# EAGLE design MicrofluidicsController (EAGLE 7.2.0)
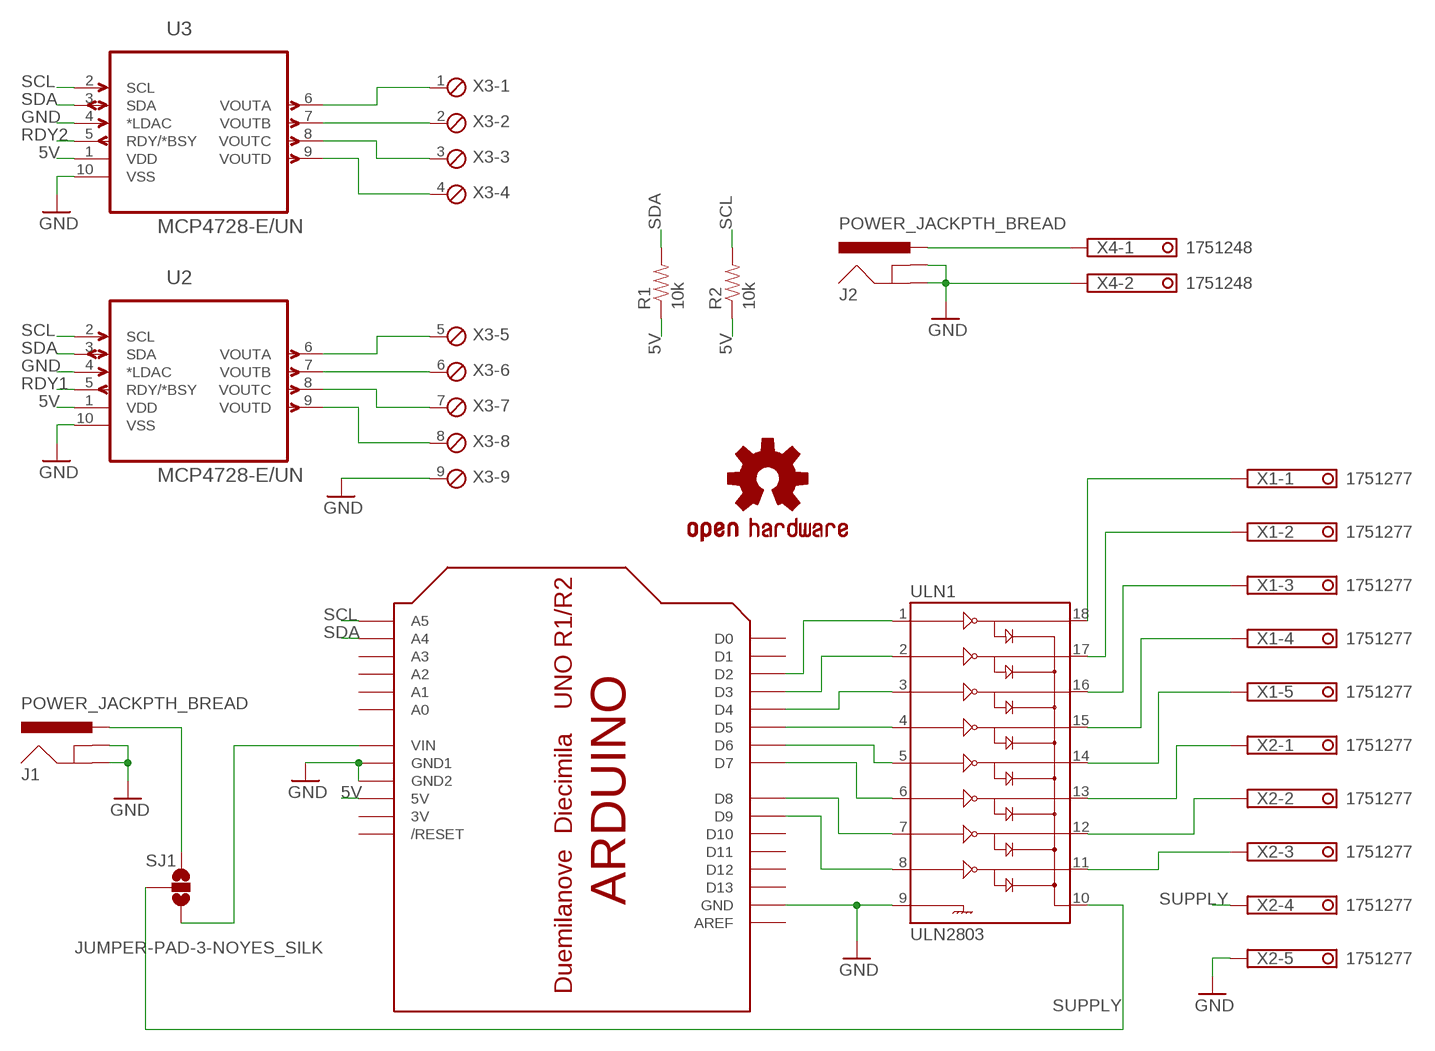
[diagram p0: schematic, sheet 1]

## Parts
J1  POWER_JACKPTH_BREAD  [POWER_JACK_PTH_BREAD]
J2  POWER_JACKPTH_BREAD  [POWER_JACK_PTH_BREAD]
LOGO1  OSHW-LOGOL  [OSHW-LOGO-L]
R1  10k  RESISTOR0603-RES  [0603-RES]
R2  10k  RESISTOR0603-RES  [0603-RES]
SJ1  JUMPER-PAD-3-NOYES_SILK  [PAD-JUMPER-3-NO_YES_SILK]
U2  MCP4728-E/UN  [SOP50P490X110-10N]
U3  MCP4728-E/UN  [SOP50P490X110-10N]
U$1  ARDUINOUNO  [ARDUINO]
ULN1  ULN2803  ULN2803DIP  [DIL18]
X1  1751277  [1751277]
X2  1751277  [1751277]
X3  MPT9  [9POL254]
X4  1751248  [1751248]

## Nets
5V: R1.1 R2.1 U2.1(VDD) U3.1(VDD) U$1.5V
GND: J1.GND J1.GNDBREAK J2.GND J2.GNDBREAK U2.4(*LDAC) U2.10(VSS) U3.4(*LDAC) U3.10(VSS) U$1.GND U$1.GND1 U$1.GND2 ULN1.9 X2.5 X3.9 X4.2
N$1: SJ1.3 U$1.VIN
N$2: U$1.D2 ULN1.1
N$3: U$1.D3 ULN1.2
N$4: U$1.D4 ULN1.3
N$5: U$1.D5 ULN1.4
N$6: U$1.D6 ULN1.5
N$7: U$1.D7 ULN1.6
N$8: U$1.D8 ULN1.7
N$9: U$1.D9 ULN1.8
N$11: J1.PWR SJ1.1
N$12: ULN1.18 X1.1
N$13: ULN1.17 X1.2
N$14: ULN1.16 X1.3
N$15: ULN1.15 X1.4
N$16: ULN1.14 X1.5
N$17: ULN1.13 X2.1
N$18: ULN1.12 X2.2
N$19: ULN1.11 X2.3
N$20: U2.6(VOUTA) X3.5
N$21: U2.7(VOUTB) X3.6
N$22: U2.8(VOUTC) X3.7
N$23: U2.9(VOUTD) X3.8
N$24: U3.6(VOUTA) X3.1
N$25: U3.7(VOUTB) X3.2
N$26: U3.8(VOUTC) X3.3
N$27: U3.9(VOUTD) X3.4
N$33: J2.PWR X4.1
RDY1: U2.5(RDY/*BSY)
RDY2: U3.5(RDY/*BSY)
SCL: R2.2 U2.2(SCL) U3.2(SCL) U$1.A5
SDA: R1.2 U2.3(SDA) U3.3(SDA) U$1.A4
SUPPLY: SJ1.2 ULN1.10 X2.4
Unconnected: U$1.A0 U$1.A1 U$1.A2 U$1.A3 U$1.AREF U$1.D0 U$1.D1 U$1.D10 U$1.D11 U$1.D12 U$1.D13 U$1.RESET(/RESET)

## Power pins joined to a net without a drawn wire
3V: U$1.3V

## Library data of the parts
J1 J2 = SparkFun-Connectors:POWER_JACK: Power Jack This is the standard 5.5mm barrel jack for power. The PTH is the most common, proven, reliable, footprint. The Slot footprint only works if the mill layer is transmitted to the PCB fab house so be warned. Mating wall wart : TOL-00298 (and others); PROD_ID: PRT-10811
LOGO1 = SparkFun-Aesthetics:OSHW-LOGO: Open Source Hardware Logo This logo indicates the piece of hardware it is found on incorporates a OSHW license and/or adheres to the definition of open source hardware found here: http://freedomdefined.org/OSHW
R1 R2 = SparkFun-Passives:RESISTOR: Resistor Basic schematic elements and footprints for 0603, 1206, and PTH resistors.
SJ1 = SparkFun-Passives:JUMPER-PAD-3-NO
U2 U3 = mylibrary:MCP4728-E/UN: IC, DAC, 12BIT, QUAD; MPN: MCP4728-E/UN; OC_FARNELL: 1800217; OC_NEWARK: 08R1808; PACKAGE: MSOP-10; SUPPLIER: MICROCHIP
U$1 = adafruit:ARDUINO: Arduino Diecimila/Duemilanove Make a shield with ease, this package has all the named pins as well as the two mounting drill holes and an outline of the USB and DC power connector. The outline is on the DIMENSION layer, so if your board house uses it they will cut the outline to match. http://www.ladyada.net/library/pcb/eaglelibrary.html
ULN1 = SparkFun-PowerIC:ULN2803: Darlington Driver ULN2803 Darlington array. 500mA max per channel, 8-channel package. Spark Fun Electronics SKU : COM-00312
X1 X2 = con-phoenix-350:1751277: MKDS 1/ 5-3,5 Printklemme Nennstrom: 10 A Bemessungsspannung: 160 V Raster: 3,5 mm Polzahl: 5 Montageart: Löten Anschlussart: Schraubanschluss Anschlussrichtung vom Leiter zur Platine: 0° Source: http://eshop.phoenixcontact.com .. 1751277.pdf; OC_FARNELL: unknown; OC_NEWARK: unknown
X3 = con-phoenix-254:MPT9: PHOENIX CONNECTOR; OC_FARNELL: unknown; OC_NEWARK: unknown
X4 = con-phoenix-350:1751248: MKDS 1/ 2-3,5 Printklemme Nennstrom: 10 A Bemessungsspannung: 160 V Raster: 3,5 mm Polzahl: 2 Montageart: Löten Anschlussart: Schraubanschluss Anschlussrichtung vom Leiter zur Platine: 0° Source: http://eshop.phoenixcontact.com .. 1751248.pdf; OC_FARNELL: unknown; OC_NEWARK: unknown

## Board
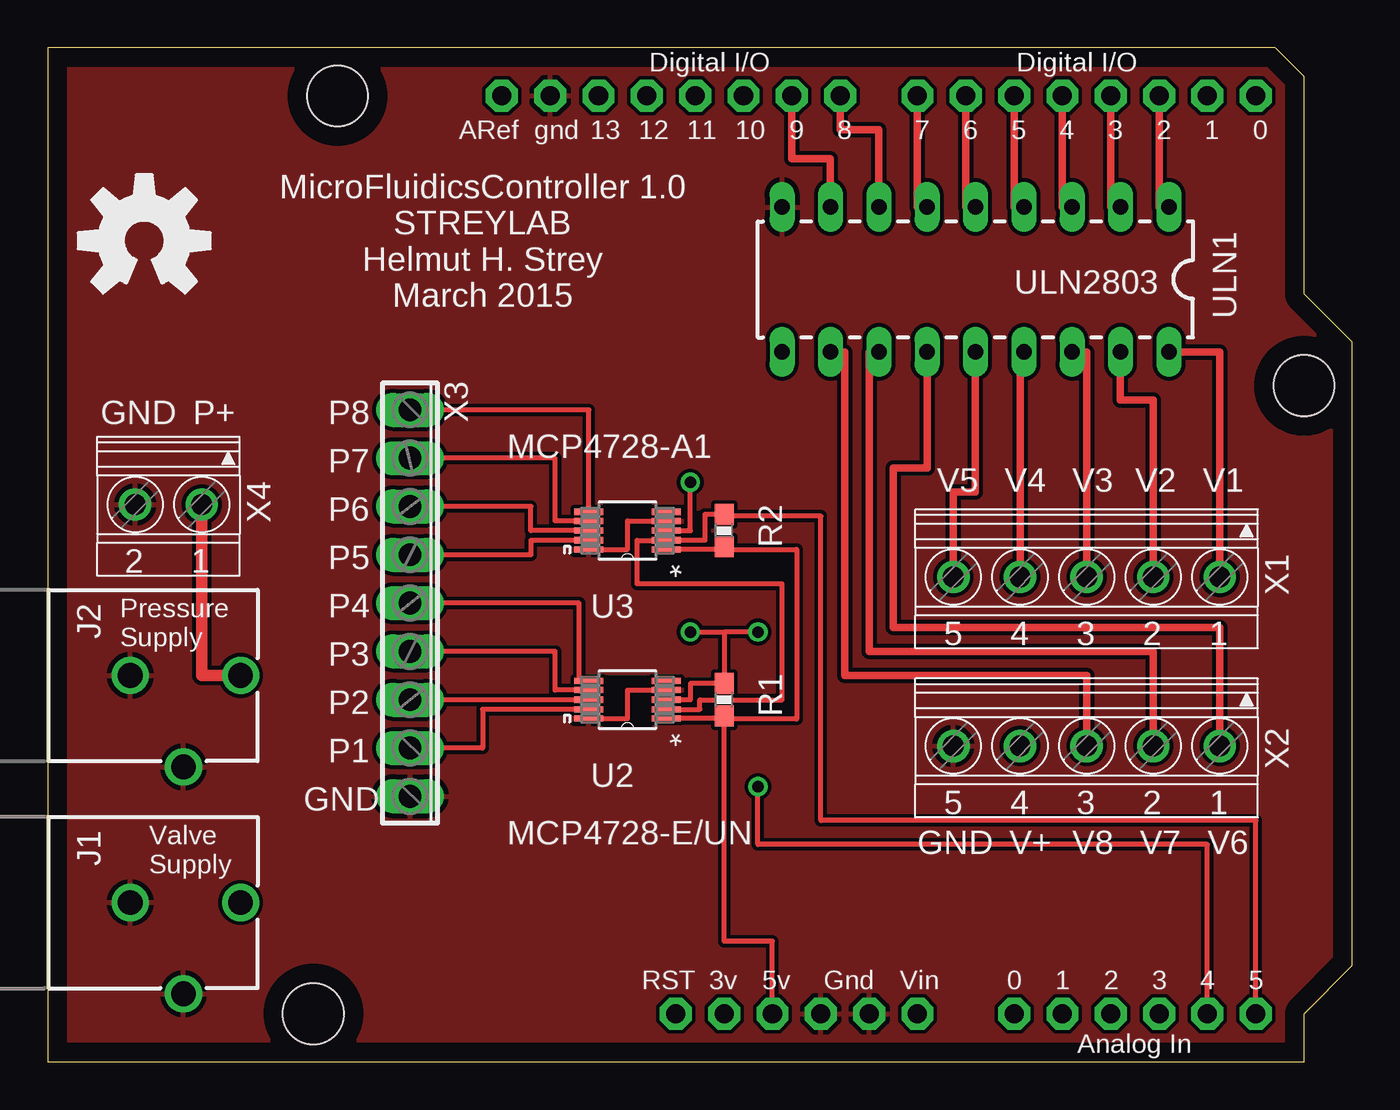
[diagram p1: board, top side]
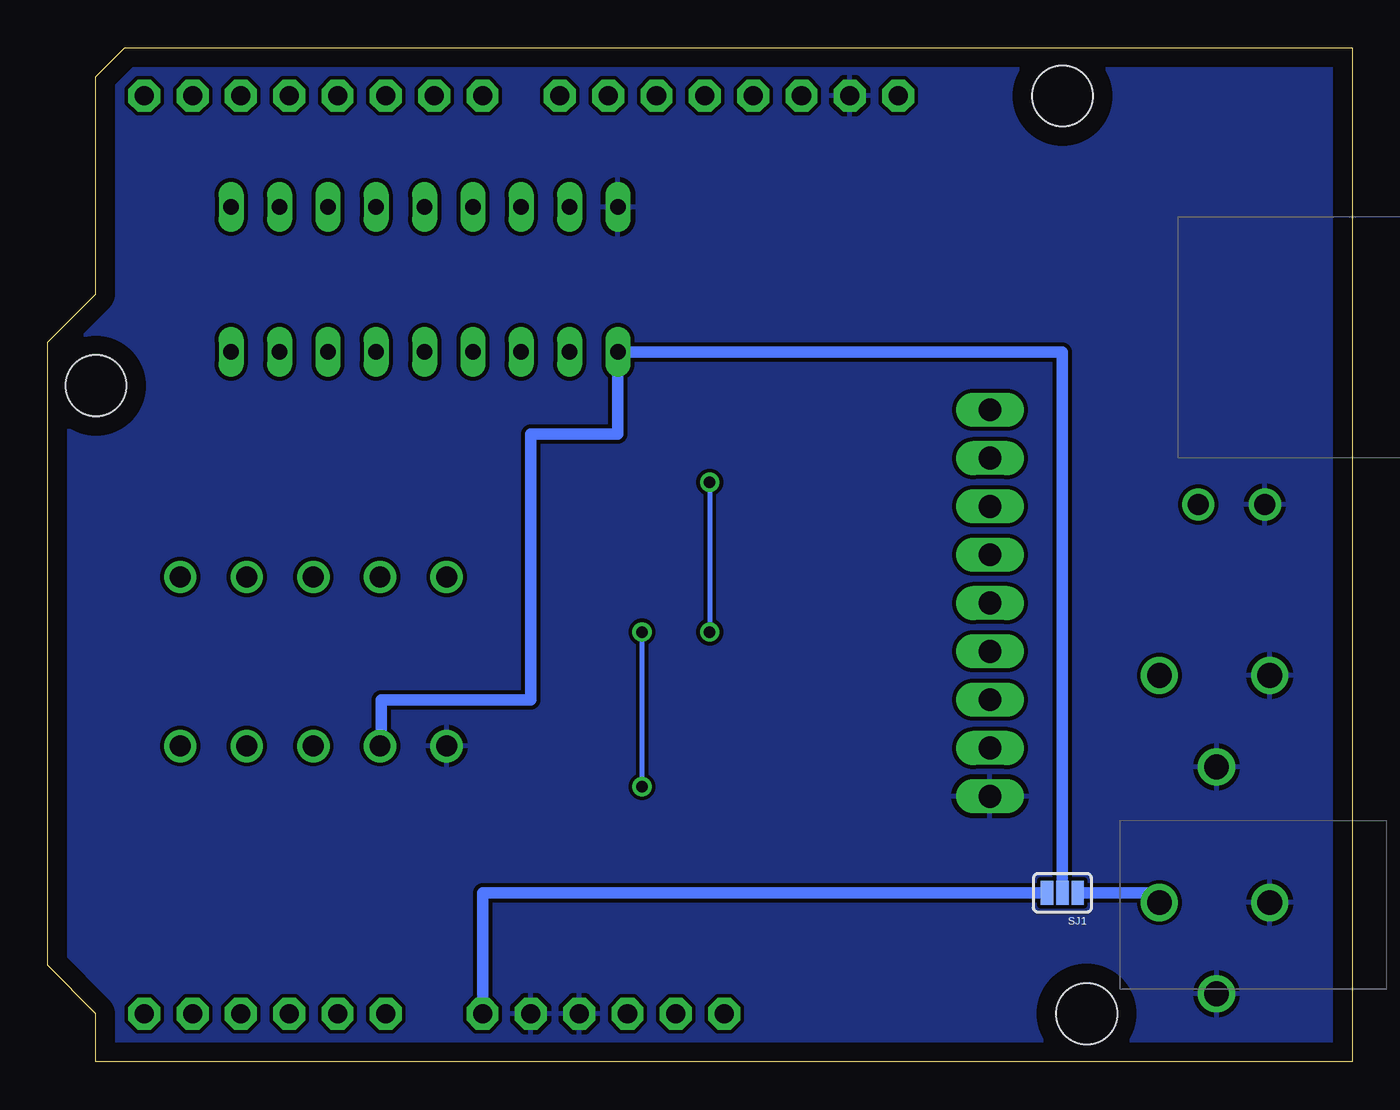
[diagram p2: board, bottom side, seen from below]

Size 68.58 x 53.34 mm. Coordinates in mm from the lower left corner, seen from the top.
Copper layers (1*16): Top 0.035mm / dielectric 1.5mm / Bottom 0.035mm
Design rules "default": minimum track width 10mil, minimum drill 24mil, track to track 8mil, track to pad 8mil, pad to pad 8mil, via to via 8mil, smd to smd 8mil, copper to edge 40mil, drill to drill 8mil, minimum pad ring 10mil, minimum via ring 8mil, stop-mask expansion 4mil, vias tented up to drill 0mil, thermal gap 10mil

### Footprints (pad centres in the part's own frame; a part is rotated, then mirrored left to right if it is on the bottom)
POWER_JACK_PTH_BREAD = drill 1.3: GND 0,7.9; GNDBREAK 4.8,10.7; PWR 0,13.7
0603-RES = smd 1.1 x 1: 1 -0.85,0; 2 0.85,0
PAD-JUMPER-3-NO_YES_SILK = smd 0.635 x 1.27: 1 -0.813,0; 2 0,0; 3 0.813,0
SOP50P490X110-10N = smd 1.524 x 0.33: 1 -2.032,0.991; 2 -2.032,0.508; 3 -2.032,0; 4 -2.032,-0.508; 5 -2.032,-0.991; 6 2.032,-0.991; 7 2.032,-0.508; 8 2.032,0; 9 2.032,0.508; 10 2.032,0.991
ARDUINO = drill 1 pad 1.676 octagon: 3V 35.56,2.54; 5V 38.1,2.54; A0 50.8,2.54; A1 53.34,2.54; A2 55.88,2.54; A3 58.42,2.54; A4 60.96,2.54; A5 63.5,2.54; AREF 23.876,50.8; D0 63.5,50.8; D1 60.96,50.8; D2 58.42,50.8; D3 55.88,50.8; D4 53.34,50.8; D5 50.8,50.8; D6 48.26,50.8; D7 45.72,50.8; D8 41.656,50.8; D9 39.116,50.8; D10 36.576,50.8; D11 34.036,50.8; D12 31.496,50.8; D13 28.956,50.8; GND 26.416,50.8; GND1 43.18,2.54; GND2 40.64,2.54; RESET 33.02,2.54; VIN 45.72,2.54 | hole 3.2: 15.24,50.8; 66.04,35.56; 13.97,2.54
DIL18 = drill 0.813 long: 1 -10.16,-3.81; 2 -7.62,-3.81; 3 -5.08,-3.81; 4 -2.54,-3.81; 5 0,-3.81; 6 2.54,-3.81; 7 5.08,-3.81; 8 7.62,-3.81; 9 10.16,-3.81; 10 10.16,3.81; 11 7.62,3.81; 12 5.08,3.81; 13 2.54,3.81; 14 0,3.81; 15 -2.54,3.81; 16 -5.08,3.81; 17 -7.62,3.81; 18 -10.16,3.81
1751277 = drill 1.1 pad 1.7: 1 -7,-0.1; 2 -3.5,-0.1; 3 0,-0.1; 4 3.5,-0.1; 5 7,-0.1
9POL254 = drill 1.2 long: 1 -10.16,0; 2 -7.62,0; 3 -5.08,0; 4 -2.54,0; 5 0,0; 6 2.54,0; 7 5.08,0; 8 7.62,0; 9 10.16,0
1751248 = drill 1.1 pad 1.7: 1 -1.75,-0.1; 2 1.75,-0.1

### Placement (x,y rotation side)
J1  -3.56,8.38 270 top
J2  -3.56,20.32 270 top
LOGO1  5.08,43.18 0 top
R1  35.56,19.05 90 top
R2  35.56,27.94 90 top
SJ1  15.24,8.89 180 bottom
U2  30.48,19.05 180 top
U3  30.48,27.94 180 top
U$1  0,0 0 top
ULN1  48.77,41.15 180 top
X1  54.61,25.4 180 top
X2  54.61,16.51 180 top
X3  19.05,24.13 270 top
X4  6.35,29.21 180 top

### Tracks (layer width: path | path; a pad name or v marks a point on that pad's centre or on a via)
5V
  Top 0.254: U$1.5V 38.1,6.35 35.56,6.35 R1.1 | R1.1 35.42,18.06 U2.1 | R2.1 35.42,26.95 | 35.42,26.95 U3.1 | 35.42,26.95 39.37,26.95 39.37,18.03 35.56,18.03 R1.1
GND
  Top 0.254: U3.10 30.48,26.95 30.48,28.45 U3.4 | U2.10 30.48,18.06 30.48,19.56 U2.4
  pour Top: 0.25,0.25 0.25,53.09 64.26,53.09 65.79,51.56 65.79,40.13 68.33,37.59 68.33,5.33 68.33,5.08 65.79,2.54 65.79,0.25
  pour Bottom: 0.25,0.25 0.25,53.09 64.26,53.09 65.79,51.56 65.79,40.13 68.33,37.59 68.33,5.33 68.33,5.08 65.79,2.54 65.79,0.25
N$1
  Bottom 0.61: U$1.VIN 45.72,8.89 SJ1.3
N$2
  Top 0.406: ULN1.1 58.42,44.96 U$1.D2
N$3
  Top 0.406: ULN1.2 55.88,44.96 U$1.D3
N$4
  Top 0.406: ULN1.3 53.34,44.96 U$1.D4
N$5
  Top 0.406: ULN1.4 50.8,44.96 U$1.D5
N$6
  Top 0.406: ULN1.5 48.26,44.96 U$1.D6
N$7
  Top 0.406: ULN1.6 45.72,44.96 U$1.D7
N$8
  Top 0.406: ULN1.7 43.69,49.02 41.66,49.02 U$1.D8
N$9
  Top 0.406: ULN1.8 41.15,47.5 39.12,47.5 U$1.D9
N$11
  Bottom 0.61: SJ1.1 10.14,8.89 J1.PWR
N$12
  Top 0.406: ULN1.18 61.61,37.34 X1.1
N$13
  Top 0.406: ULN1.17 56.39,34.8 58.11,34.8 X1.2
N$14
  Top 0.406: ULN1.16 54.61,37.34 X1.3
N$15
  Top 0.406: ULN1.15 51.11,37.34 X1.4
N$16
  Top 0.406: ULN1.14 48.77,29.97 47.61,29.97 X1.5
N$17
  Top 0.406: ULN1.13 46.23,31.24 44.45,31.24 44.45,22.86 61.61,22.86 X2.1
N$18
  Top 0.406: ULN1.12 43.18,37.34 43.18,21.59 58.11,21.59 X2.2
N$19
  Top 0.406: ULN1.11 41.91,37.34 41.91,20.32 54.61,20.32 X2.3
N$20
  Top 0.254: U2.6 27.94,20.04 27.94,24.13 X3.5
N$21
  Top 0.254: U2.7 26.67,19.56 26.67,21.59 X3.6
N$22
  Top 0.254: U2.8 X3.7
N$23
  Top 0.254: U2.9 22.86,18.54 22.86,16.51 X3.8
N$24
  Top 0.254: U3.6 28.45,34.29 X3.1
N$25
  Top 0.254: U3.7 26.67,28.45 26.67,31.75 X3.2
N$26
  Top 0.254: U3.8 25.4,27.94 25.4,29.21 X3.3
N$27
  Top 0.254: U3.9 25.4,27.43 25.4,26.67 X3.4
N$33
  Top 0.61: J2.PWR 8.1,20.32 X4.1
N$34
  cutout Top (no thermals): 29.21,20.32 31.75,20.32 31.75,17.53 29.21,17.53
N$35
  cutout Top (no thermals): 29.21,29.46 31.75,29.46 31.75,26.42 29.21,26.42
SCL
  Top 0.254: U$1.A5 63.5,12.7 40.64,12.7 40.64,28.7 35.56,28.7 R2.2 34.54,28.79 34.54,27.43 U3.2 30.99,27.43 30.99,25.15 38.61,25.15 38.61,19.05 34.29,19.05 34.29,18.54 U2.2
SDA  (via drill 0.6)
  Top 0.254: U$1.A4 60.96,11.43 37.34,11.43 v37.34,14.48 | v37.34,22.61 35.56,22.61 | 35.56,22.61 R1.2 33.78,19.9 33.78,19.05 U2.3 | U3.3 33.78,27.94 v33.78,30.48 | v33.78,22.61 35.56,22.61
  Bottom 0.254: v37.34,14.48 v37.34,22.61 | v33.78,30.48 v33.78,22.61
SUPPLY
  Bottom 0.406: 51.05,16.61 X2.4
  Bottom 0.61: SJ1.2 15.24,37.34 ULN1.10 38.61,33.02 43.18,33.02 43.18,19.05 51.05,19.05 51.05,16.61

### Text on the board
tPlace: MicroFluidicsController 1.0 / STREYLAB / Helmut H. Strey / March 2015 | ULN2803 | GND | P+ | P8 | MCP4728-A1 | P7 | V5 | V4 | V3 | V2 | V1 | P6 | P5 | P4 | Pressure / Supply | P3 | P2 | P1 | GND | MCP4728-E/UN | GND | V+ | V8 | V7 | V6 | Valve / Supply